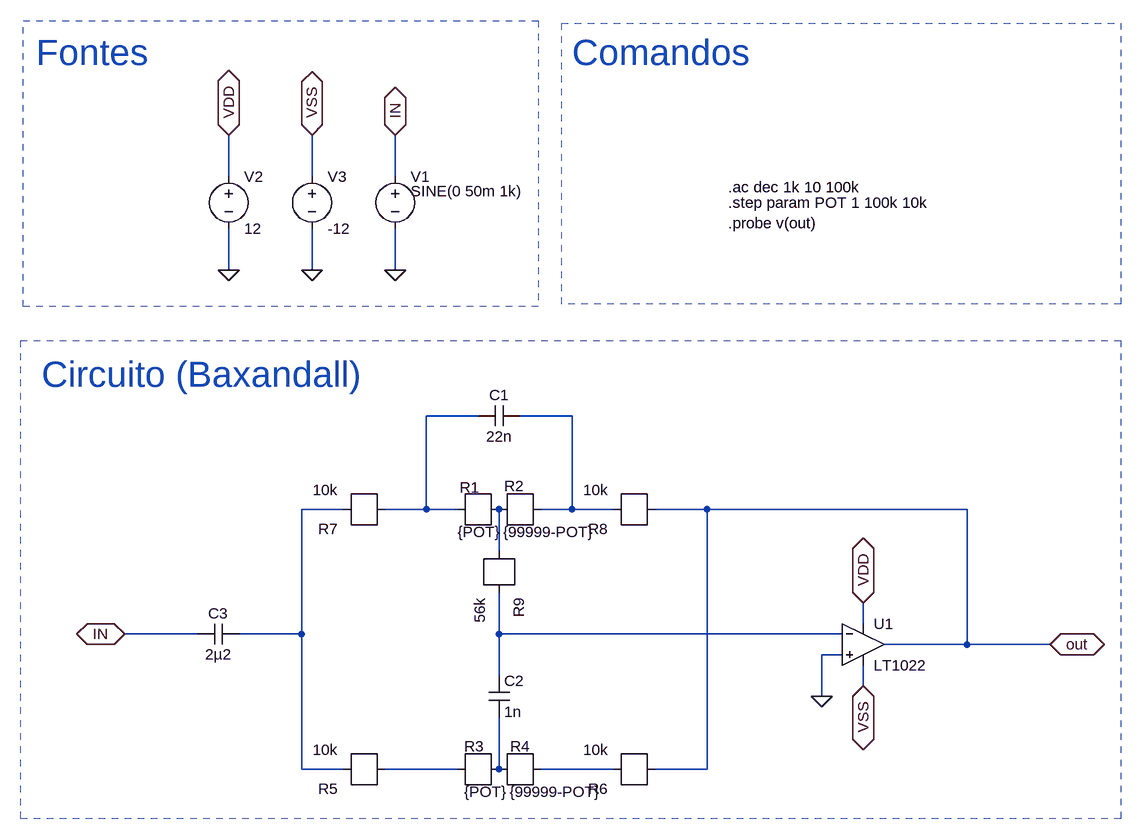
[diagram p0: schematic 4_step.asc]
4_step.asc, the LTspice schematic file:
Version 4
SHEET 1 2352 1568
WIRE -32 48 -32 -16
WIRE 96 48 96 -16
WIRE 224 48 224 -16
WIRE -32 192 -32 128
WIRE 96 192 96 128
WIRE 224 192 224 128
WIRE 352 416 272 416
WIRE 496 416 416 416
WIRE 144 560 80 560
WIRE 272 560 272 416
WIRE 272 560 208 560
WIRE 320 560 272 560
WIRE 496 560 496 416
WIRE 496 560 448 560
WIRE 560 560 496 560
WIRE 704 560 624 560
WIRE 1104 560 704 560
WIRE 384 624 384 560
WIRE 944 736 944 704
WIRE -80 752 -192 752
WIRE 80 752 80 560
WIRE 80 752 -16 752
WIRE 384 752 384 688
WIRE 912 752 384 752
WIRE 1104 768 1104 560
WIRE 1104 768 976 768
WIRE 1232 768 1104 768
WIRE 912 784 880 784
WIRE 384 816 384 752
WIRE 944 832 944 800
WIRE 880 848 880 784
WIRE 80 960 80 752
WIRE 144 960 80 960
WIRE 320 960 208 960
WIRE 384 960 384 880
WIRE 560 960 448 960
WIRE 704 960 704 560
WIRE 704 960 624 960
FLAG 880 848 0
FLAG 224 192 0
FLAG 1232 768 out
IOPIN 1232 768 BiDir
FLAG 224 -16 IN
IOPIN 224 -16 BiDir
FLAG 944 832 VSS
IOPIN 944 832 BiDir
FLAG 944 704 VDD
IOPIN 944 704 BiDir
FLAG -32 -16 VDD
IOPIN -32 -16 BiDir
FLAG -32 192 0
FLAG 96 -16 VSS
IOPIN 96 -16 BiDir
FLAG 96 192 0
FLAG -192 752 IN
IOPIN -192 752 BiDir
SYMBOL r 384 560 R180
WINDOW 0 61 34 Right 2
WINDOW 3 64 -35 Right 2
SYMATTR InstName R1
SYMATTR Value {POT}
SYMBOL r 448 560 R180
WINDOW 0 56 36 Right 2
WINDOW 3 58 -35 Right 2
SYMATTR InstName R2
SYMATTR Value {99999-POT}
SYMBOL r 384 960 R180
WINDOW 0 54 35 Right 2
WINDOW 3 54 -35 Right 2
SYMATTR InstName R3
SYMATTR Value {POT}
SYMBOL r 448 960 R180
WINDOW 0 47 35 Right 2
WINDOW 3 48 -35 Right 2
SYMATTR InstName R4
SYMATTR Value {99999-POT}
SYMBOL r 208 960 R180
SYMATTR InstName R5
SYMATTR Value 10k
SYMBOL r 624 960 R180
SYMATTR InstName R6
SYMATTR Value 10k
SYMBOL r 208 560 R180
SYMATTR InstName R7
SYMATTR Value 10k
SYMBOL r 624 560 R180
SYMATTR InstName R8
SYMATTR Value 10k
SYMBOL r 384 624 R90
SYMATTR InstName R9
SYMATTR Value 56k
SYMBOL cap 416 400 R90
WINDOW 0 0 32 VBottom 2
WINDOW 3 32 32 VTop 2
SYMATTR InstName C1
SYMATTR Value 22n
SYMBOL cap 368 816 R0
SYMATTR InstName C2
SYMATTR Value 1n
SYMBOL voltage 224 32 R0
WINDOW 3 24 38 Left 2
SYMATTR Value SINE(0 50m 1k)
SYMATTR InstName V1
SYMATTR Value2 AC 1
SYMBOL voltage -32 32 R0
SYMATTR InstName V2
SYMATTR Value 12
SYMBOL voltage 96 32 R0
SYMATTR InstName V3
SYMATTR Value -12
SYMBOL opamps/LT1022 944 704 R0
SYMATTR InstName U1
SYMBOL cap -16 736 R90
WINDOW 0 0 32 VBottom 2
WINDOW 3 32 32 VTop 2
SYMATTR InstName C3
SYMATTR Value 2µ2
TEXT 736 64 Left 2 !.ac dec 1k 10 100k
TEXT 736 88 Left 2 !.step param POT 1 100k 10k\n.probe v(out)
TEXT -328 -144 Left 5 ;Fontes
TEXT -320 352 Left 5 ;Circuito (Baxandall)
TEXT 496 -144 Left 5 ;Comandos
RECTANGLE Normal 444 248 -348 -192 2
RECTANGLE Normal 1340 1036 -352 300 2
RECTANGLE Normal 480 -188 1340 244 2

The netlist it stands for:
* 4_step.asc
R1 N001 N004 {POT}
R2 N004 N002 {99999-POT}
R3 N006 N007 {POT}
R4 N007 N008 {99999-POT}
R5 N003 N006 10k
R6 N008 out 10k
R7 N003 N001 10k
R8 N002 out 10k
R9 N005 N004 56k
C1 N002 N001 22n
C2 N005 N007 1n
V1 IN 0 SINE(0 50m 1k) AC 1
V2 VDD 0 12
V3 VSS 0 -12
XU1 0 N005 VDD VSS out LT1022  ; pins In+ In- V+ V- OUT
C3 N003 IN 2µ2
.ac dec 1k 10 100k
.step param POT 1 100k 10k
.probe v(out)
* Fontes
* Circuito (Baxandall)
* Comandos
.backanno
.end